# EAGLE design MORIKAWA_DS (EAGLE 5.11)
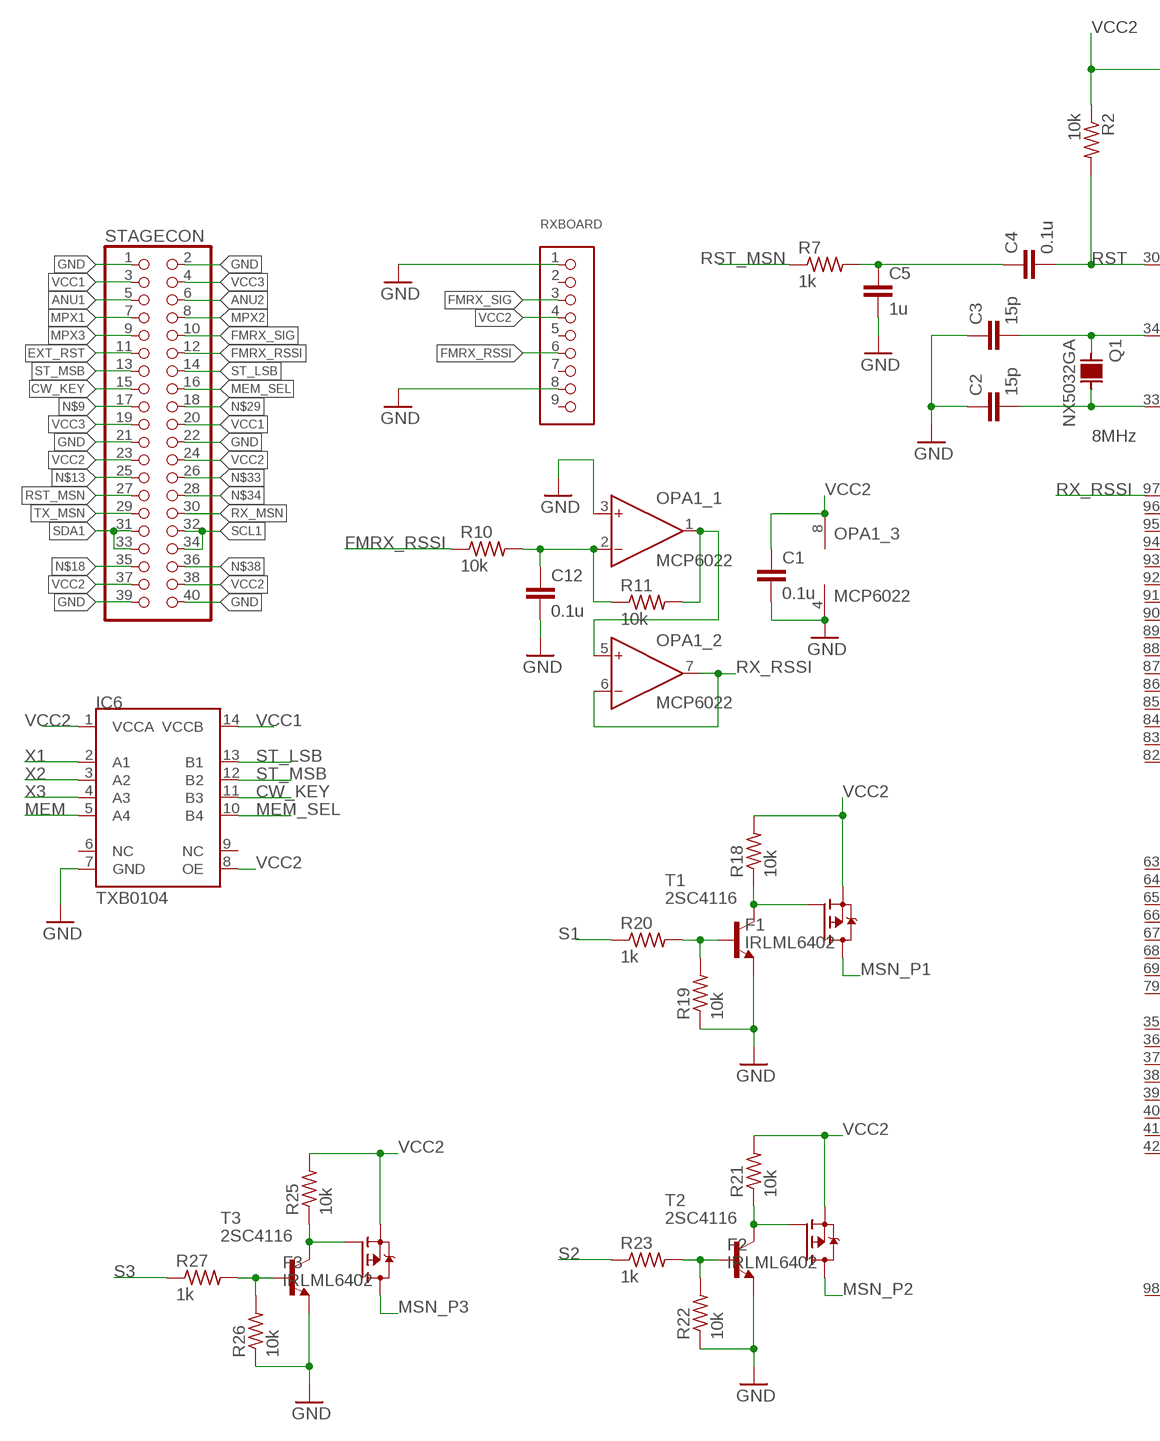
[diagram p0: schematic, sheet 1, part 1 of 2]
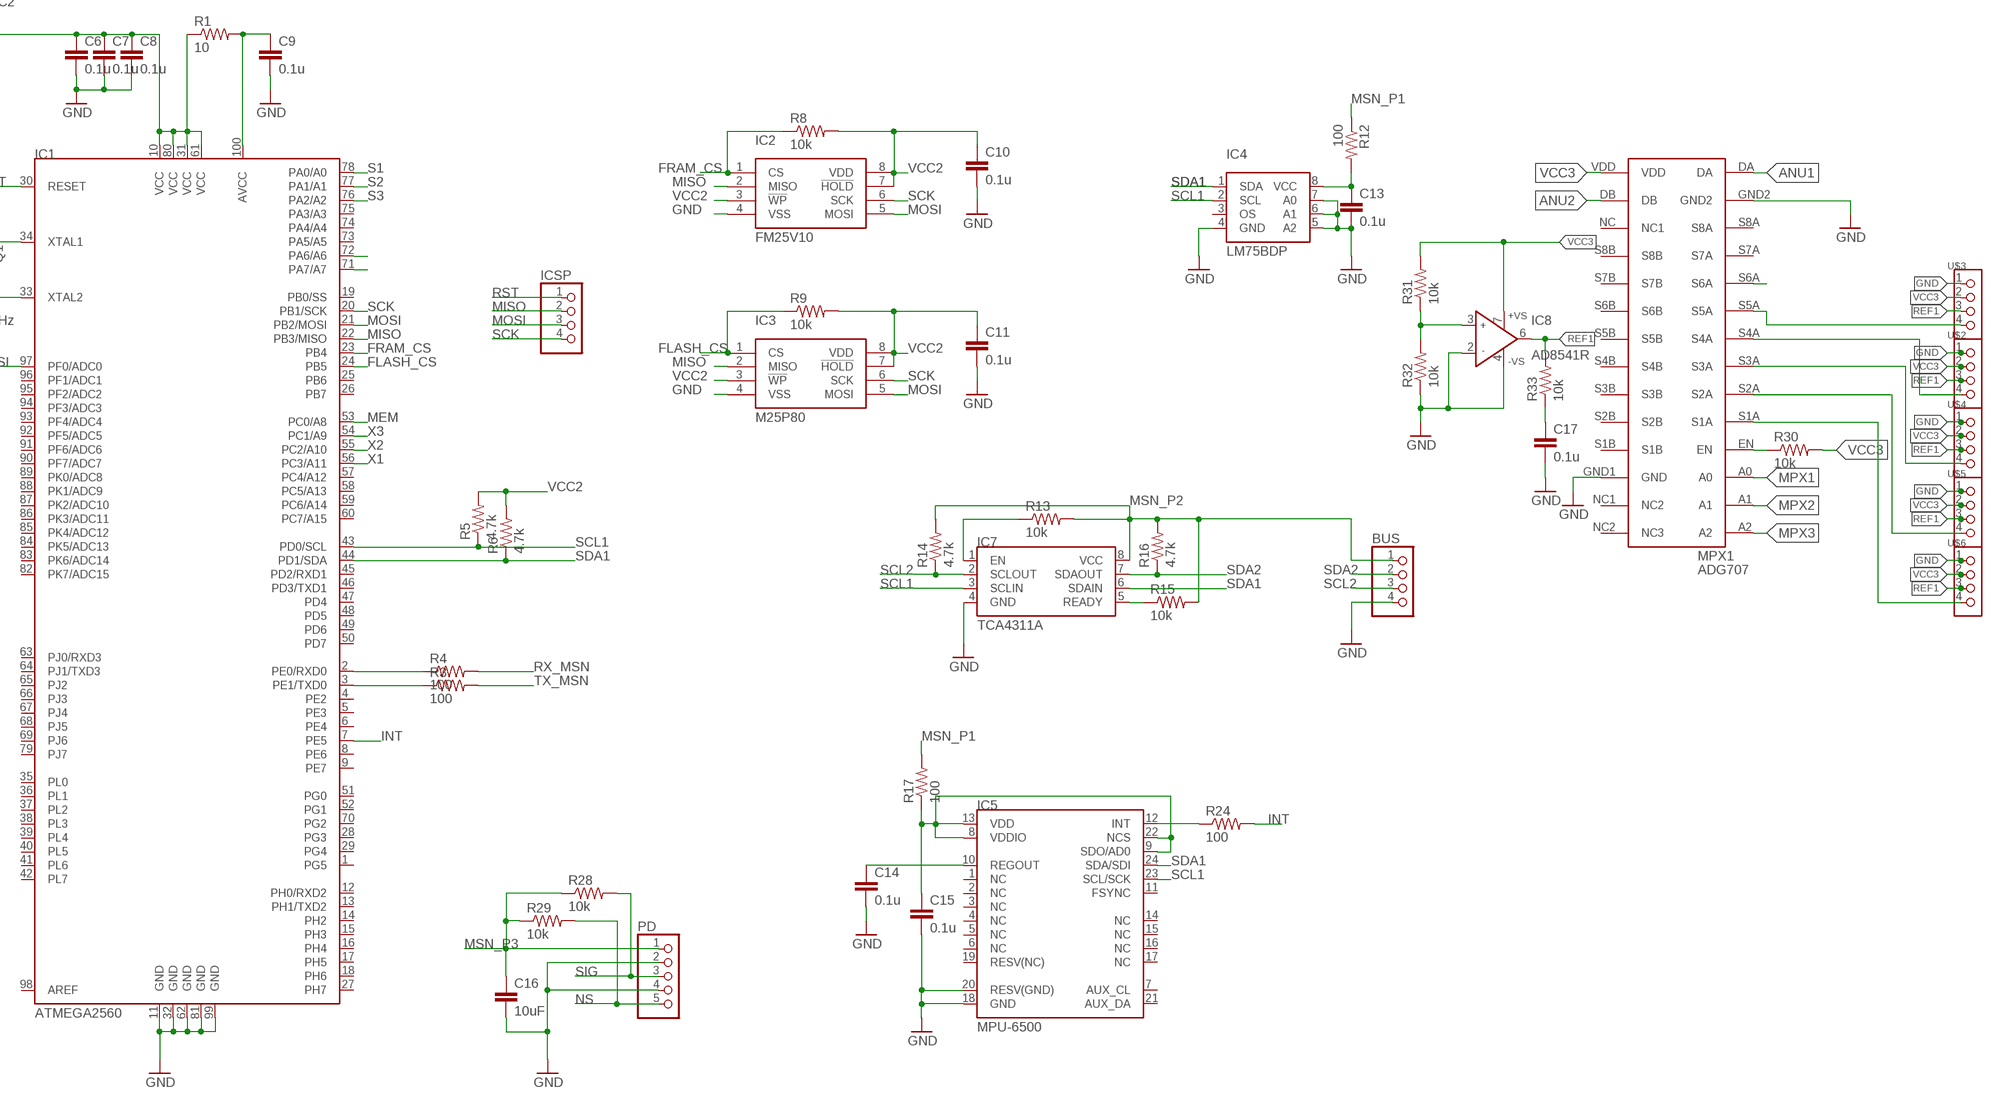
[diagram p1: schematic, sheet 1, part 2 of 2]

## Parts
BUS  PINHD-1X4  [1X04]
C1  0.1u  C-EUC0603  [C1608(0603)]
C2  15p  C-EUC0402  [C1015(0402)]
C3  15p  C-EUC0402  [C1015(0402)]
C4  0.1u  C-EUC0603  [C1608(0603)]
C5  1u  C-EUC0603  [C1608(0603)]
C6  0.1u  C-EUC0402  [C1015(0402)]
C7  0.1u  C-EUC0402  [C1015(0402)]
C8  0.1u  C-EUC0402  [C1015(0402)]
C9  0.1u  C-EUC0402  [C1015(0402)]
C10  0.1u  C-EUC0402  [C1015(0402)]
C11  0.1u  C-EUC0402  [C1015(0402)]
C12  0.1u  C-EUC0402  [C1015(0402)]
C13  0.1u  C-EUC0402  [C1015(0402)]
C14  0.1u  C-EUC0402  [C1015(0402)]
C15  0.1u  C-EUC0402  [C1015(0402)]
C16  10uF  C-EUC0805  [C2012(0805)]
C17  0.1u  C-EUC0402  [C1015(0402)]
F1  IRLML6402  [SOT23]
F2  IRLML6402  [SOT23]
F3  IRLML6402  [SOT23]
IC1  ATMEGA2560  [TQFP100]
IC2  FM25V10  [SO08]
IC3  M25P80  FM25V10  [SO08]
IC4  LM75BDP  [TSSOP8]
IC5  MPU-6500  [QFN24]
IC6  TXB0104  [PW-14]
IC7  TCA4311A  [SO08]
IC8  AD8541R  [SO8]
ICSP  PINHD-1X4  [1X04]
MPX1  ADG707  [ADG707]
OPA1  MCP6022  [SO8]
PD  PINHD-1X5  [1X05]
Q1  NX5032GA  [NX5032GA]
R1  10  R-US_R0402  [R1005M(0603)]
R2  10k  R-US_R0402  [R1005M(0603)]
R3  100  R-US_R0402  [R1005M(0603)]
R4  100  R-US_R0402  [R1005M(0603)]
R5  4.7k  R-US_R0402  [R1005M(0603)]
R6  4.7k  R-US_R0402  [R1005M(0603)]
R7  1k  R-US_R0402  [R1005M(0603)]
R8  10k  R-US_R0402  [R1005M(0603)]
R9  10k  R-US_R0402  [R1005M(0603)]
R10  10k  R-US_R0402  [R1005M(0603)]
R11  10k  R-US_R0402  [R1005M(0603)]
R12  100  R-US_R0402  [R1005M(0603)]
R13  10k  R-US_R0402  [R1005M(0603)]
R14  4.7k  R-US_R0402  [R1005M(0603)]
R15  10k  R-US_R0402  [R1005M(0603)]
R16  4.7k  R-US_R0402  [R1005M(0603)]
R17  100  R-US_R0402  [R1005M(0603)]
R18  10k  R-US_R0402  [R1005M(0603)]
R19  10k  R-US_R0402  [R1005M(0603)]
R20  1k  R-US_R0402  [R1005M(0603)]
R21  10k  R-US_R0402  [R1005M(0603)]
R22  10k  R-US_R0402  [R1005M(0603)]
R23  1k  R-US_R0402  [R1005M(0603)]
R24  100  R-US_R0402  [R1005M(0603)]
R25  10k  R-US_R0402  [R1005M(0603)]
R26  10k  R-US_R0402  [R1005M(0603)]
R27  1k  R-US_R0402  [R1005M(0603)]
R28  10k  R-US_R0402  [R1005M(0603)]
R29  10k  R-US_R0402  [R1005M(0603)]
R30  10k  R-US_R0402  [R1005M(0603)]
R31  10k  R-US_R0402  [R1005M(0603)]
R32  10k  R-US_R0402  [R1005M(0603)]
R33  10k  R-US_R0402  [R1005M(0603)]
RXBOARD  RXBOARD  [RXBOARD]
STAGECON  PINHD-2X20  [2X20]
T1  2SC4116  [SC-70]
T2  2SC4116  [SC-70]
T3  2SC4116  [SC-70]
U$2  ZH-4-S  [ZH4P]
U$3  ZH-4-S  [ZH4P]
U$4  ZH-4-S  [ZH4P]
U$5  ZH-4-S  [ZH4P]
U$6  ZH-4-S  [ZH4P]

## Nets
ANU1: MPX1.DA STAGECON.5
ANU2: MPX1.DB STAGECON.6
CW_KEY: IC6.11(B3) STAGECON.15
EXT_RST: STAGECON.11
FLASH_CS: IC1.24(PB5) IC3.1(CS) R9.1
FMRX_RSSI: R10.1 RXBOARD.6 STAGECON.12
FMRX_SIG: RXBOARD.3 STAGECON.10
FRAM_CS: IC1.23(PB4) IC2.1(CS) R8.1
GND: BUS.4 C1.2 C2.1 C3.1 C5.2 C6.2 C7.2 C8.2 C9.2 C10.2 C11.2 C12.2 C13.2 C14.2 C15.2 C16.2 C17.2 IC1.11(GND) IC1.32(GND) IC1.62(GND) IC1.81(GND) IC1.99(GND) IC2.4(VSS) IC3.4(VSS) IC4.4(GND) IC4.5(A2) IC4.6(A1) IC4.7(A0) IC5.18(GND) IC5.20(RESV(GND)) IC6.7(GND) IC7.4(GND) IC8.2(IN-) IC8.4(-VS) MPX1.GND1(GND) MPX1.GND2 OPA1.3(_1:IN+) OPA1.4(_3:V-) PD.2 PD.4 R19.1 R22.1 R26.1 R32.1 RXBOARD.1 RXBOARD.8 STAGECON.1 STAGECON.2 STAGECON.21 STAGECON.22 STAGECON.39 STAGECON.40 T1.2(E) T2.2(E) T3.2(E) U$2.1 U$3.1 U$4.1 U$5.1 U$6.1
INT: IC1.7(PE5) R24.2
MEM: IC1.53(PC0/A8) IC6.5(A4)
MEM_SEL: IC6.10(B4) STAGECON.16
MISO: IC1.22(PB3/MISO) IC2.2(MISO) IC3.2(MISO) ICSP.2
MOSI: IC1.21(PB2/MOSI) IC2.5(MOSI) IC3.5(MOSI) ICSP.3
MPX1: MPX1.A0 STAGECON.7
MPX2: MPX1.A1 STAGECON.8
MPX3: MPX1.A2 STAGECON.9
MSN_P1: F1.3(D) R12.1 R17.2
MSN_P2: BUS.1 F2.3(D) IC7.8(VCC) R13.2 R14.2 R15.2 R16.2
MSN_P3: C16.1 F3.3(D) PD.1 R28.1 R29.1
N$1: IC5.12(INT) R24.1
N$2: C9.1 IC1.100(AVCC) R1.2
N$3: C12.1 OPA1.2(_1:IN-) R10.2 R11.1
N$4: C3.2 IC1.34(XTAL1) Q1.1
N$5: C2.2 IC1.33(XTAL2) Q1.2
N$6: IC1.2(PE0/RXD0) R4.1
N$7: IC1.3(PE1/TXD0) R3.1
N$8: C14.1 IC5.10(REGOUT)
N$9: STAGECON.17
N$10: F1.1(G) R18.1 T1.3(C)
N$11: OPA1.1(_1:OUT) OPA1.5(_2:IN+) R11.2
N$12: F2.1(G) R21.1 T2.3(C)
N$13: STAGECON.25
N$14: C13.1 IC4.8(VCC) R12.2
N$15: F3.1(G) R25.1 T3.3(C)
N$16: C4.1 C5.1 R7.2
N$17: R26.2 R27.2 T3.1(B)
N$18: STAGECON.35
N$19: IC7.5(READY) R15.1
N$20: IC7.1(EN) R13.1
N$21: R19.2 R20.2 T1.1(B)
N$22: IC1.72(PA6/A6)
N$23: C15.1 IC5.8(VDDIO) IC5.9(SDO/AD0) IC5.13(VDD) IC5.22(NCS) R17.1
N$24: R22.2 R23.2 T2.1(B)
N$25: IC1.71(PA7/A7)
N$27: MPX1.S1A U$6.4
N$28: MPX1.EN R30.1
N$29: STAGECON.18
N$30: MPX1.S2A U$5.4
N$31: MPX1.S3A U$4.4
N$32: MPX1.S4A U$2.4
N$33: STAGECON.26
N$34: STAGECON.28
N$35: IC8.3(IN+) R31.1 R32.2
N$36: MPX1.S5A U$3.4
N$37: MPX1.S6A
N$38: STAGECON.36
N$39: C17.1 R33.1
NS: PD.5 R29.2
REF1: IC8.6(OUT) R33.2 U$2.3 U$3.3 U$4.3 U$5.3 U$6.3
RST: C4.2 IC1.30(RESET) ICSP.1 R2.2
RST_MSN: R7.1 STAGECON.27
RX_MSN: R4.2 STAGECON.30
RX_RSSI: IC1.97(PF0/ADC0) OPA1.6(_2:IN-) OPA1.7(_2:OUT)
S1: IC1.78(PA0/A0) R20.1
S2: IC1.77(PA1/A1) R23.1
S3: IC1.76(PA2/A2) R27.1
SCK: IC1.20(PB1/SCK) IC2.6(SCK) IC3.6(SCK) ICSP.4
SCL1: IC1.43(PD0/SCL) IC4.2(SCL) IC5.23(SCL/SCK) IC7.3(SCLIN) R5.1 STAGECON.32 STAGECON.34
SCL2: BUS.3 IC7.2(SCLOUT) R14.1
SDA1: IC1.44(PD1/SDA) IC4.1(SDA) IC5.24(SDA/SDI) IC7.6(SDAIN) R6.1 STAGECON.31 STAGECON.33
SDA2: BUS.2 IC7.7(SDAOUT) R16.1
SIG: PD.3 R28.2
ST_LSB: IC6.13(B1) STAGECON.14
ST_MSB: IC6.12(B2) STAGECON.13
TX_MSN: R3.2 STAGECON.29
VCC1: IC6.14(VCCB) STAGECON.3 STAGECON.20
VCC2: C1.1 C6.1 C7.1 C8.1 C10.1 C11.1 F1.2(S) F2.2(S) F3.2(S) IC1.10(VCC) IC1.31(VCC) IC1.61(VCC) IC1.80(VCC) IC2.3(!WP) IC2.7(!HOLD) IC2.8(VDD) IC3.3(!WP) IC3.7(!HOLD) IC3.8(VDD) IC6.1(VCCA) IC6.8(OE) OPA1.8(_3:V+) R1.1 R2.1 R5.2 R6.2 R8.2 R9.2 R18.2 R21.2 R25.2 RXBOARD.4 STAGECON.23 STAGECON.24 STAGECON.37 STAGECON.38
VCC3: IC8.7(+VS) MPX1.VDD R30.2 R31.2 STAGECON.4 STAGECON.19 U$2.2 U$3.2 U$4.2 U$5.2 U$6.2
X1: IC1.56(PC3/A11) IC6.2(A1)
X2: IC1.55(PC2/A10) IC6.3(A2)
X3: IC1.54(PC1/A9) IC6.4(A3)
Unconnected: IC1.1(PG5) IC1.4(PE2) IC1.5(PE3) IC1.6(PE4) IC1.8(PE6) IC1.9(PE7) IC1.12(PH0/RXD2) IC1.13(PH1/TXD2) IC1.14(PH2) IC1.15(PH3) IC1.16(PH4) IC1.17(PH5) IC1.18(PH6) IC1.19(PB0/SS) IC1.25(PB6) IC1.26(PB7) IC1.27(PH7) IC1.28(PG3) IC1.29(PG4) IC1.35(PL0) IC1.36(PL1) IC1.37(PL2) IC1.38(PL3) IC1.39(PL4) IC1.40(PL5) IC1.41(PL6) IC1.42(PL7) IC1.45(PD2/RXD1) IC1.46(PD3/TXD1) IC1.47(PD4) IC1.48(PD5) IC1.49(PD6) IC1.50(PD7) IC1.51(PG0) IC1.52(PG1) IC1.57(PC4/A12) IC1.58(PC5/A13) IC1.59(PC6/A14) IC1.60(PC7/A15) IC1.63(PJ0/RXD3) IC1.64(PJ1/TXD3) IC1.65(PJ2) IC1.66(PJ3) IC1.67(PJ4) IC1.68(PJ5) IC1.69(PJ6) IC1.70(PG2) IC1.73(PA5/A5) IC1.74(PA4/A4) IC1.75(PA3/A3) IC1.79(PJ7) IC1.82(PK7/ADC15) IC1.83(PK6/ADC14) IC1.84(PK5/ADC13) IC1.85(PK4/ADC12) IC1.86(PK3/ADC11) IC1.87(PK2/ADC10) IC1.88(PK1/ADC9) IC1.89(PK0/ADC8) IC1.90(PF7/ADC7) IC1.91(PF6/ADC6) IC1.92(PF5/ADC5) IC1.93(PF4/ADC4) IC1.94(PF3/ADC3) IC1.95(PF2/ADC2) IC1.96(PF1/ADC1) IC1.98(AREF) IC4.3(OS) IC5.1(NC) IC5.2(NC) IC5.3(NC) IC5.4(NC) IC5.5(NC) IC5.6(NC) IC5.7(AUX_CL) IC5.11(FSYNC) IC5.14(NC) IC5.15(NC) IC5.16(NC) IC5.17(NC) IC5.19(RESV(NC)) IC5.21(AUX_DA) IC6.6(NC) IC6.9(NC) MPX1.NC1(NC2) MPX1.NC2(NC3) MPX1.NC(NC1) MPX1.S1B MPX1.S2B MPX1.S3B MPX1.S4B MPX1.S5B MPX1.S6B MPX1.S7A MPX1.S7B MPX1.S8A MPX1.S8B RXBOARD.2 RXBOARD.5 RXBOARD.7 RXBOARD.9

## Notes on the sheet
- 8MHz

## Library data of the parts
BUS = Basic_parts:PINHD-1X4: PIN HEADER
C1-C17 = capacitor:C-EU: CAPACITOR, European symbol
F1-F3 = FET:IRLML6402: IRLML6402 P-ch MosFET
IC1 = avr:ATMEGA2560: ATmega1280/2560 TQFP100 ATmega1280
IC2 IC3 = IC:FM25V10: SPI FRAM Cypress http://www.digikey.jp/product-detail/ja/FM25VN10-GTR/1140-1029-1-ND/2917720
IC4 = IC:LM75B: I2C Temp sensor NXP
IC5 = sensor:MPU-6500: invensense 6-axis Motion tracking device
IC6 = Levelconverter:TXB0104: TXB0104 4-BIT BIDIRECTIONAL VOLTAGE-LEVEL TRANSLATOR WITH AUTOMATIC DIRECTION SENSING AND ±15-kV ESD PROTECTION, TI
IC7 = Levelconverter:TCA4311A: hot swappable 2wire bus buffers TI
IC8 = IC:AD8541: General-Purpose CMOS Rail-to-Rail Amplifiers Source: http://www.analog.com/static/imported-files/data_sheets/AD8541_8542_8544.pdf; MPN: AD8541ARZ; OC_FARNELL: 9603859; OC_NEWARK: 31M4547
ICSP = PINHEAD_round:PINHD-1X4: PIN HEADER
MPX1 = ADG707:ADG707
OPA1 = OPamp:MCP6022: microchip buffer amp rail-to-rail http://ww1.microchip.com/downloads/en/DeviceDoc/21685d.pdf
PD = Basic_parts:PINHD-1X5: PIN HEADER
Q1 = OSC:NX5032GA: NX5032CA Nihon Denpa Kogyo Crystal SMD
R1-R33 = Resistor:R-US_: RESISTOR, American symbol
RXBOARD = util:RXBOARD
STAGECON = Basic:PINHD-2X20: PIN HEADER
T1-T3 = Transisitor:2SC4116: NPN Transistor 2SC4116
U$2-U$6 = ZHcon:ZH-4-S

## Board
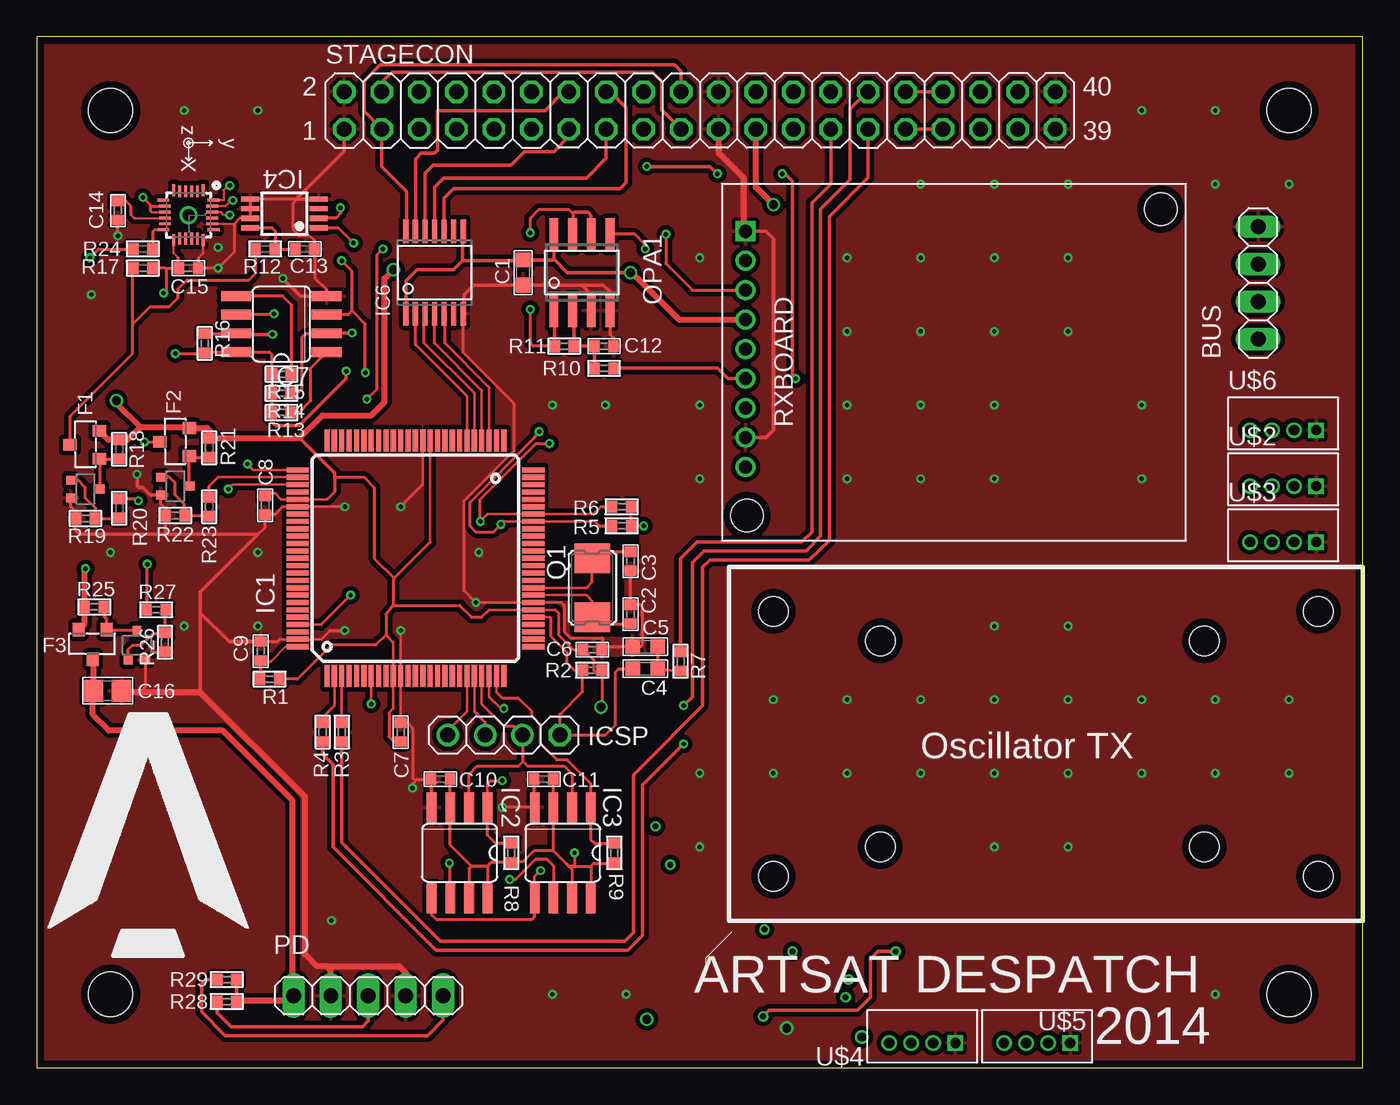
[diagram p2: board, top side]
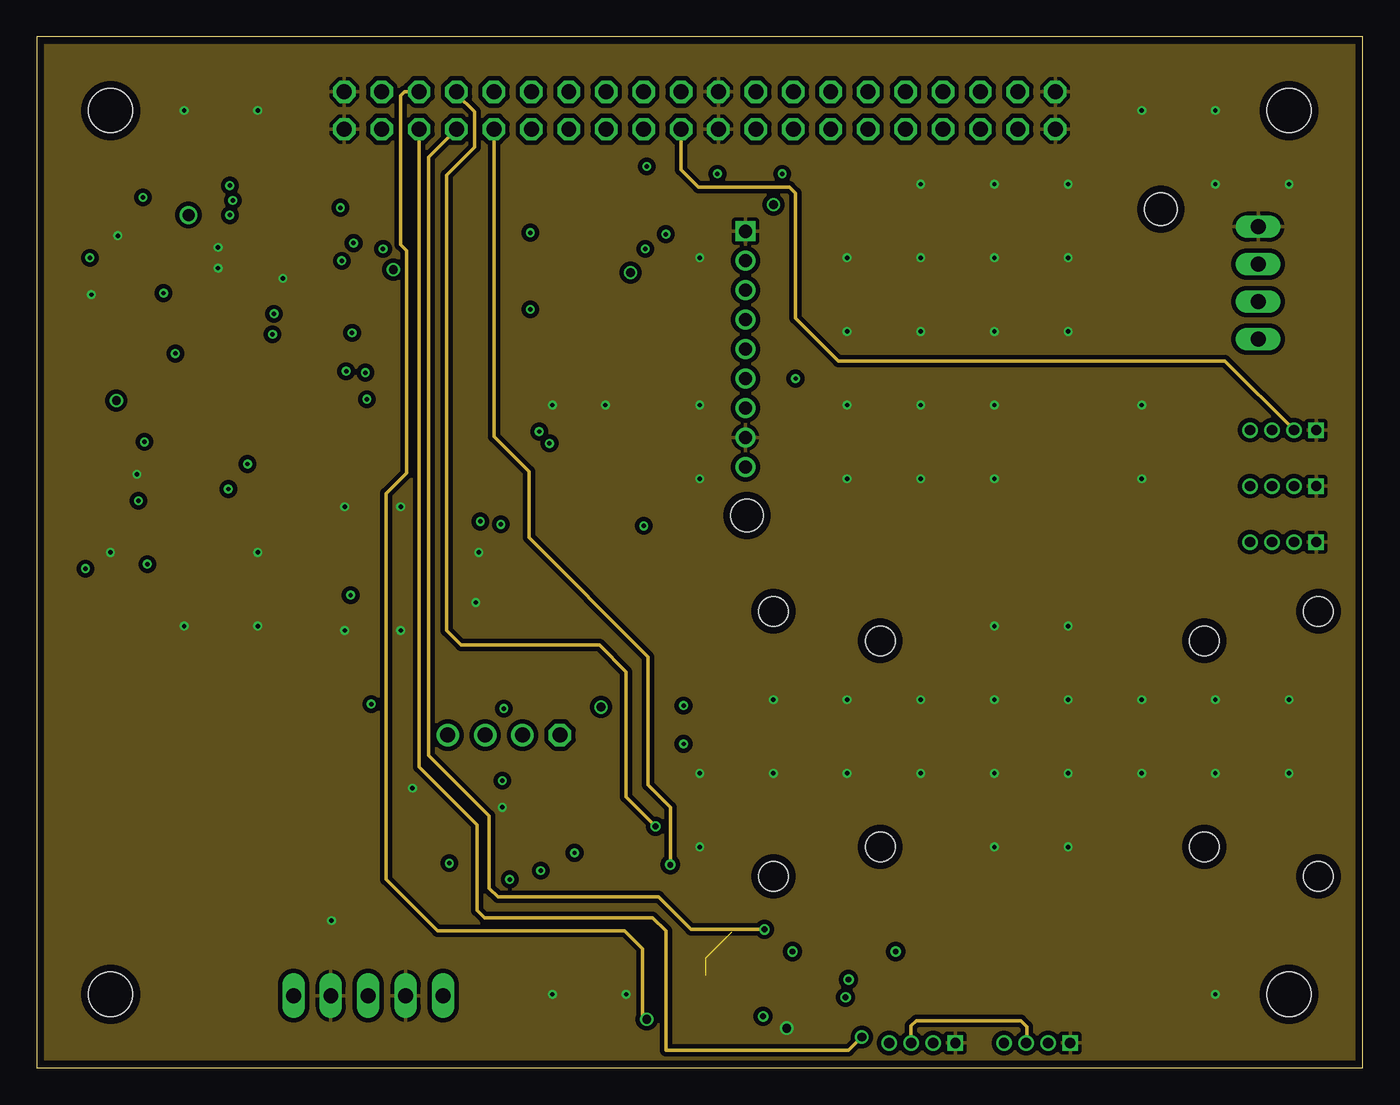
[diagram p3: board, inner layer Route2]
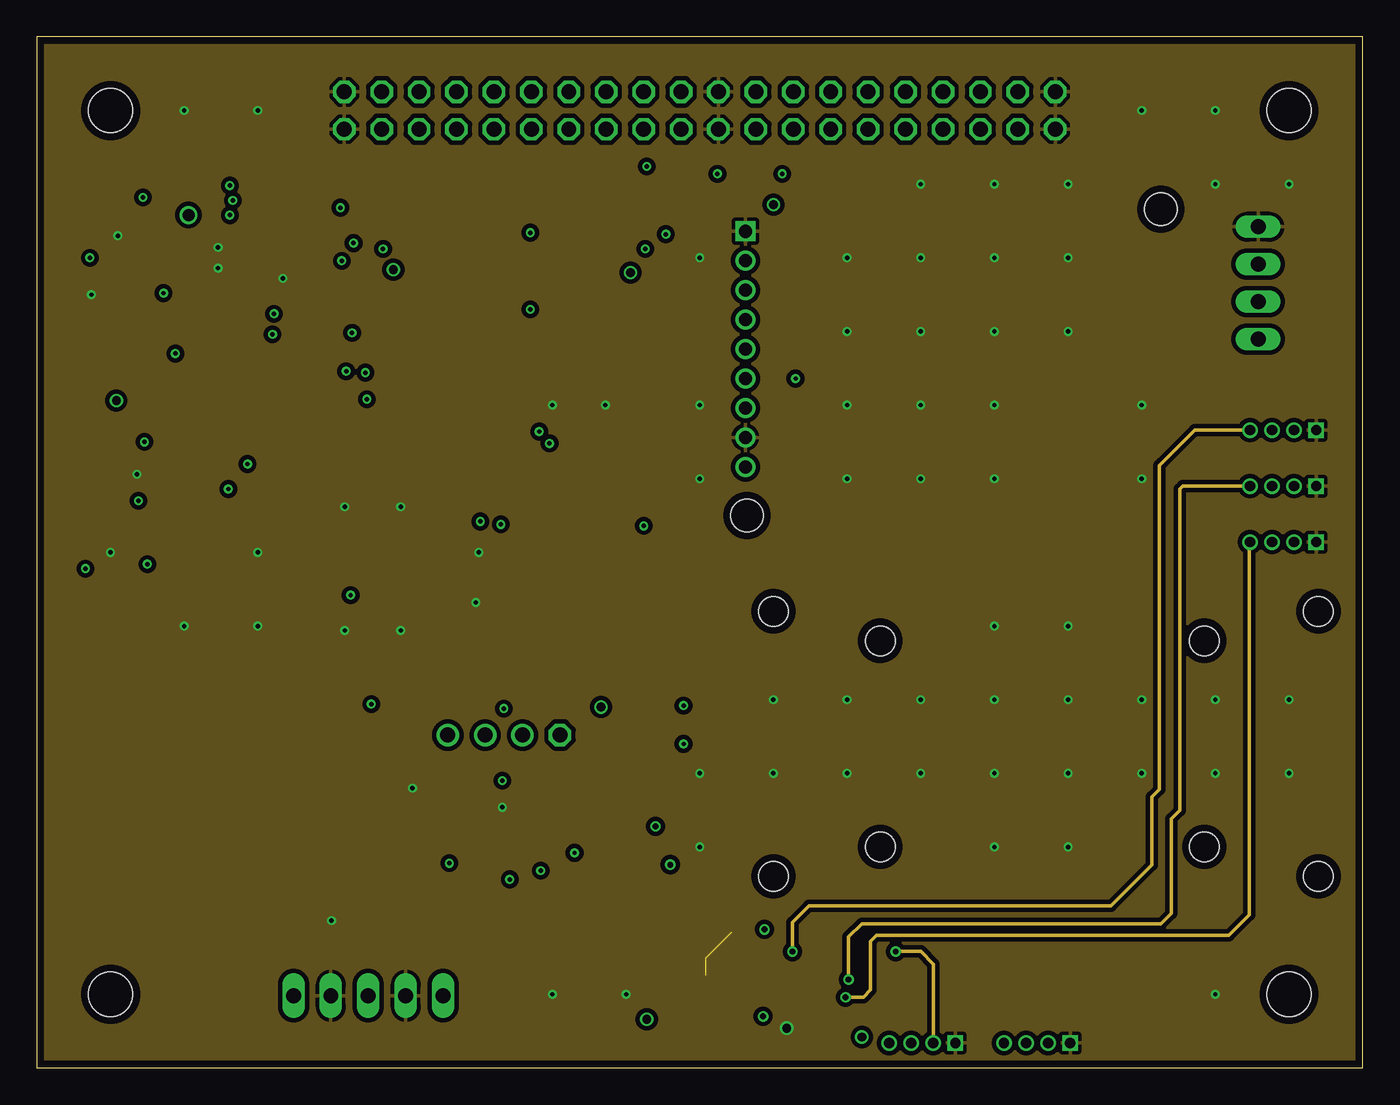
[diagram p4: board, inner layer Route15]
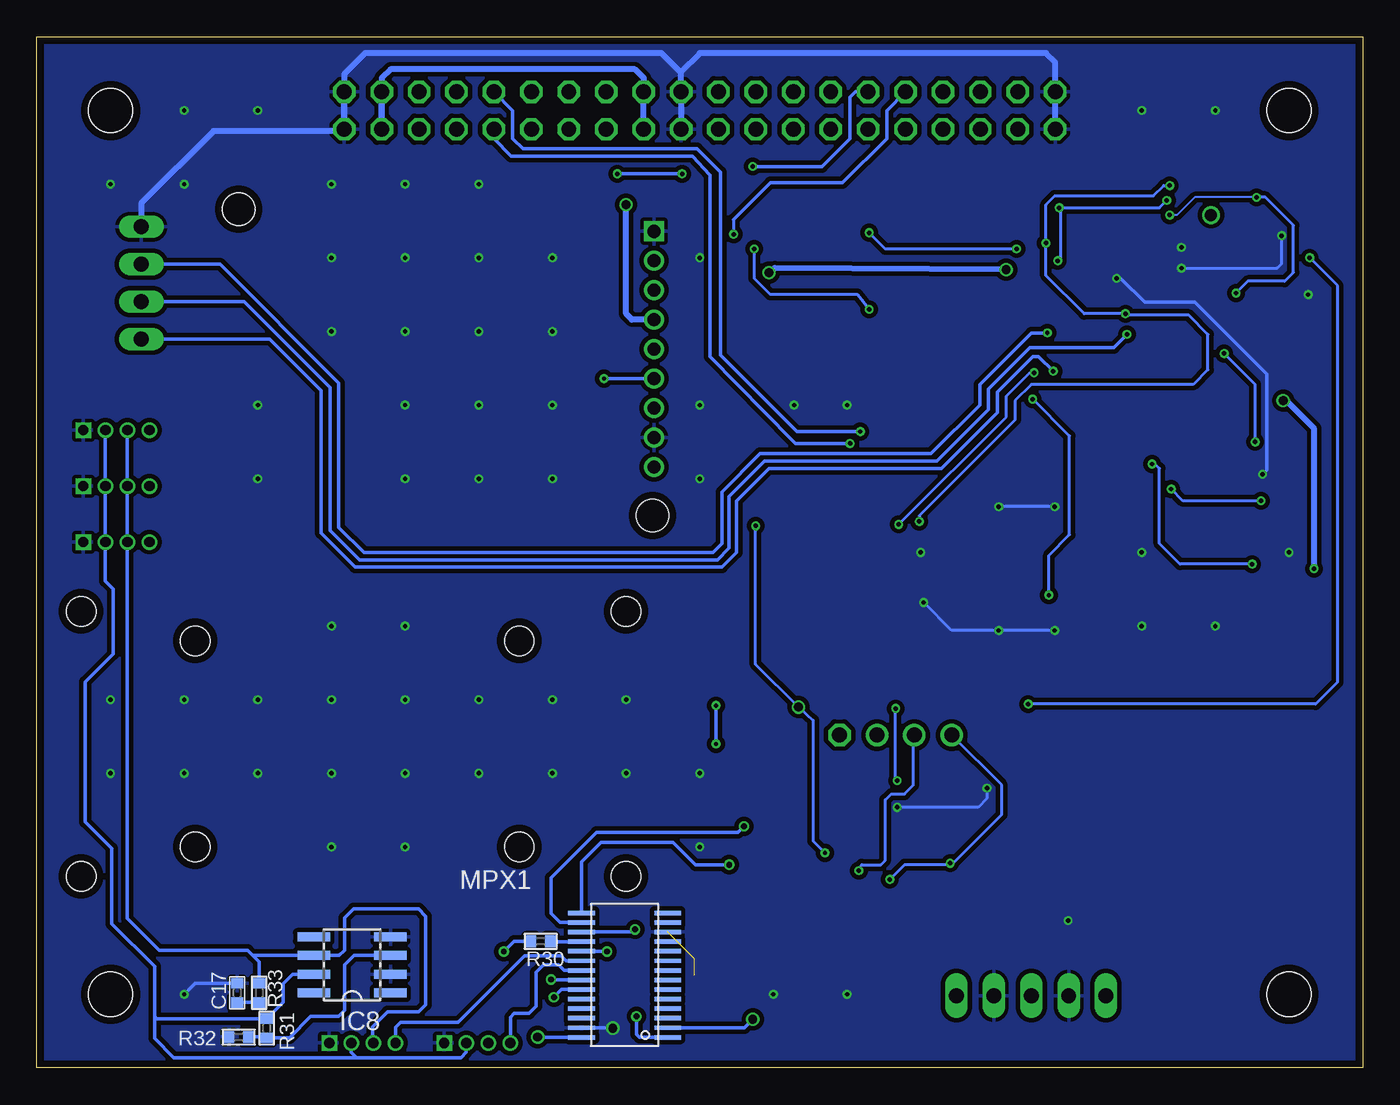
[diagram p5: board, bottom side, seen from below]

Size 90 x 70 mm. Coordinates in mm from the lower left corner, seen from the top.
Outline: 0,0 90,0 90,70 0,70 0,0
Copper layers (1+2*15+16): Top 0.018mm / dielectric 0.25mm / Route2 0.035mm / dielectric 1mm / Route15 0.035mm / dielectric 0.25mm / Bottom 0.018mm
Design rules "pban_5mil-l4": minimum track width 5mil, minimum drill 0.3mm, track to track 5mil, track to pad 0.229mm, pad to pad 5mil, via to via 5mil, smd to smd 5mil, copper to edge 0.5mm, drill to drill 0.5mm, minimum pad ring 0.15mm, minimum via ring 0.15mm, stop-mask expansion 4mil, vias tented up to drill 0.35mm, thermal gap 10mil
Holes 3 mm at 5,65 85,65 5,5 85,5
Holes 2 mm at 87,31 87,13 50,13 50,31 57.25,29 79.25,29 79.25,15 57.25,15
tRestrict: area 38.2,32 to 39,33.2; area 39.4,30.6 to 39.6,34.8; area 34.8,33 to 36.2,36.6; area 36.4,36 to 38.4,36.6; area 39,35.8 to 40.6,36; area 39.2,29.6 to 39.6,29.8; area 39,27.4 to 39.6,27.6; area 32.2,26.8 to 33.2,27.4; area 33,26.8 to 33.4,28; area 18.6,28 to 18.8,28.2; area 18.8,28.6 to 19.2,28.8; area 16.2,38.2 to 16.4,38.4

### Footprints (pad centres in the part's own frame; a part is rotated, then mirrored left to right if it is on the bottom)
1X04 = drill 1.016 long: 1 -3.81,0; 2 -1.27,0; 3 1.27,0; 4 3.81,0
C1608(0603) = smd 1 x 1: 1 -0.85,0; 2 0.85,0
C1015(0402) = smd 0.7 x 0.8: 1 -0.65,0; 2 0.65,0
C2012(0805) = smd 1.3 x 1.5: 1 -0.95,0; 2 0.95,0
SOT23 = smd 0.8 x 0.9: 1 -0.95,-0.95; 2 0.95,-0.95; 3 0,1.05
TQFP100 = smd 1.5 x 0.35: 1 -8,6; 2 -8,5.5; 3 -8,5; 4 -8,4.5; 5 -8,4; 6 -8,3.5; 7 -8,3; 8 -8,2.5; 9 -8,2; 10 -8,1.5; 11 -8,1; 12 -8,0.5; 13 -8,0; 14 -8,-0.5; 15 -8,-1; 16 -8,-1.5; 17 -8,-2; 18 -8,-2.5; 19 -8,-3; 20 -8,-3.5; 21 -8,-4; 22 -8,-4.5; 23 -8,-5; 24 -8,-5.5; 25 -8,-6; 51 8,-6; 52 8,-5.5; 53 8,-5; 54 8,-4.5; 55 8,-4; 56 8,-3.5; 57 8,-3; 58 8,-2.5; 59 8,-2; 60 8,-1.5; 61 8,-1; 62 8,-0.5; 63 8,0; 64 8,0.5; 65 8,1; 66 8,1.5; 67 8,2; 68 8,2.5; 69 8,3; 70 8,3.5; 71 8,4; 72 8,4.5; 73 8,5; 74 8,5.5; 75 8,6 | smd 0.35 x 1.5: 26 -6,-8; 27 -5.5,-8; 28 -5,-8; 29 -4.5,-8; 30 -4,-8; 31 -3.5,-8; 32 -3,-8; 33 -2.5,-8; 34 -2,-8; 35 -1.5,-8; 36 -1,-8; 37 -0.5,-8; 38 0,-8; 39 0.5,-8; 40 1,-8; 41 1.5,-8; 42 2,-8; 43 2.5,-8; 44 3,-8; 45 3.5,-8; 46 4,-8; 47 4.5,-8; 48 5,-8; 49 5.5,-8; 50 6,-8; 76 6,8; 77 5.5,8; 78 5,8; 79 4.5,8; 80 4,8; 81 3.5,8; 82 3,8; 83 2.5,8; 84 2,8; 85 1.5,8; 86 1,8; 87 0.5,8; 88 0,8; 90 -1,8; 92 -2,8; 93 -2.5,8; 94 -3,8; 95 -3.5,8; 96 -4,8; 97 -4.5,8; 98 -5,8; 99 -5.5,8; 100 -6,8 | smd 0.34 x 1.5: 89 -0.5,8; 91 -1.5,8
SO08 = smd 0.66 x 2.032: 1 -1.905,-3.073; 2 -0.635,-3.073; 3 0.635,-3.073; 4 1.905,-3.073; 5 1.905,3.073; 6 0.635,3.073; 7 -0.635,3.073; 8 -1.905,3.073
TSSOP8 = smd 1.2 x 0.35: 1 -2.325,0.975; 2 -2.325,0.325; 3 -2.325,-0.325; 4 -2.325,-0.975; 5 2.325,-0.975; 6 2.325,-0.325; 7 2.325,0.325; 8 2.325,0.975
QFN24 = smd 0.8 x 0.2: 1 -1.7,1; 2 -1.6,0.6; 3 -1.6,0.2; 4 -1.6,-0.2; 5 -1.6,-0.6; 6 -1.7,-1; 13 1.7,-1; 14 1.6,-0.6; 15 1.6,-0.2; 16 1.6,0.2; 17 1.6,0.6; 18 1.7,1 | smd 0.2 x 0.8: 7 -1,-1.7; 8 -0.6,-1.6; 9 -0.2,-1.6; 10 0.2,-1.6; 11 0.6,-1.6; 12 1,-1.7; 19 1,1.7; 20 0.6,1.6; 21 0.2,1.6; 22 -0.2,1.6; 23 -0.6,1.6; 24 -1,1.7
PW-14 = smd 0.35 x 1.6: 1 -1.95,-2.8; 2 -1.3,-2.8; 3 -0.65,-2.8; 4 0,-2.8; 5 0.65,-2.8; 6 1.3,-2.8; 7 1.95,-2.8; 8 1.95,2.8; 9 1.3,2.8; 10 0.65,2.8; 11 0,2.8; 12 -0.65,2.8; 13 -1.3,2.8; 14 -1.95,2.8
SO8 = smd 0.6 x 2.2: 1 -1.905,-2.6; 2 -0.635,-2.6; 3 0.635,-2.6; 4 1.905,-2.6; 5 1.905,2.6; 6 0.635,2.6; 7 -0.635,2.6; 8 -1.905,2.6
1X04' = drill 1.016 octagon: 1 -3.81,0 | drill 1.016 round: 2 -1.27,0; 3 1.27,0; 4 3.81,0
ADG707 = smd 1.8 x 0.3: A0 2.925,-2.925; A1 2.925,-3.575; A2 2.925,-4.225; DA 2.925,4.225; DB -2.925,3.575; EN 2.925,-2.275; GND1 -2.925,-2.925; GND2 2.925,3.575; NC -2.925,-3.575; NC1 -2.925,2.925; NC2 -2.925,-4.225; S1A 2.925,-1.625; S1B -2.925,-2.275; S2A 2.925,-0.975; S2B -2.925,-1.625; S3A 2.925,-0.325; S3B -2.925,-0.975; S4A 2.925,0.325; S4B -2.925,-0.325; S5A 2.925,0.975; S5B -2.925,0.325; S6A 2.925,1.625; S6B -2.925,0.975; S7A 2.925,2.275; S7B -2.925,1.625; S8A 2.925,2.925; S8B -2.925,2.275; VDD -2.925,4.225
1X05 = drill 1.016 long: 1 -5.08,0; 2 -2.54,0; 3 0,0; 4 2.54,0; 5 5.08,0
NX5032GA = smd 2 x 2.4: 1 -2,0; 2 2,0
R1005M(0603) = smd 0.7 x 0.8: 1 -0.65,0; 2 0.65,0
RXBOARD = drill 0.9 square: 1 29.9,3.2 | drill 0.9 round: 2 29.9,5.2; 3 29.9,7.2; 4 29.9,9.2; 5 29.9,11.2; 6 29.9,13.2; 7 29.9,15.2; 8 29.9,17.2; 9 29.9,19.2 | hole 2.2: 1.7,1.7; 29.8,22.5
2X20 = drill 1.016 octagon: 1 -24.13,-1.27; 2 -24.13,1.27; 3 -21.59,-1.27; 4 -21.59,1.27; 5 -19.05,-1.27; 6 -19.05,1.27; 7 -16.51,-1.27; 8 -16.51,1.27; 9 -13.97,-1.27; 10 -13.97,1.27; 11 -11.43,-1.27; 12 -11.43,1.27; 13 -8.89,-1.27; 14 -8.89,1.27; 15 -6.35,-1.27; 16 -6.35,1.27; 17 -3.81,-1.27; 18 -3.81,1.27; 19 -1.27,-1.27; 20 -1.27,1.27; 21 1.27,-1.27; 22 1.27,1.27; 23 3.81,-1.27; 24 3.81,1.27; 25 6.35,-1.27; 26 6.35,1.27; 27 8.89,-1.27; 28 8.89,1.27; 29 11.43,-1.27; 30 11.43,1.27; 31 13.97,-1.27; 32 13.97,1.27; 33 16.51,-1.27; 34 16.51,1.27; 35 19.05,-1.27; 36 19.05,1.27; 37 21.59,-1.27; 38 21.59,1.27; 39 24.13,-1.27; 40 24.13,1.27
SC-70 = smd 0.6 x 0.6: 1 -1,0.6; 2 -1,-0.6; 3 1,0
ZH4P = drill 0.7 square: 1 2.25,0 | drill 0.7 round: 2 0.75,0; 3 -0.75,0; 4 -2.25,0

### Placement (x,y rotation side)
BUS  82.9,53.3 90 top
C1  33,54 270 top
C2  40.3,30.8 270 top
C3  40.3,34.4 90 top
C4  41.3,27.1 180 top
C5  41.3,28.6 180 top
C6  37.7,28.4 0 top
C7  24.7,22.8 90 top
C8  15.5,38.2 270 top
C9  15.2,28.3 90 top
C10  27.4,19.6 180 top
C11  34.4,19.6 180 top
C12  38.5,49 0 top
C13  18.2,55.6 0 top
C14  5.5,58.2 270 top
C15  10.3,54.3 0 top
C16  4.8,25.6 0 top
C17  76.4,5.1 90 bottom
F1  3.3,42.3 90 top
F2  9.4,42.5 90 top
F3  3.8,28.8 180 top
IC1  25.7,34.6 90 top
IC2  28.7,14.6 180 top
IC3  35.7,14.6 180 top
IC4  16.8,58 180 top
IC5  10.3,57.9 270 top
IC6  27,54 0 top
IC7  16.6,50.5 90 top
IC8  68.6,7 90 bottom
ICSP  [1X04']  31.7,22.6 180 top
MPX1  50.1,6.3 180 bottom
OPA1  37,54 0 top
PD  22.5,4.9 0 top
Q1  37.7,32.6 270 top
R1  15.8,26.4 180 top
R2  37.7,27 180 top
R3  20.7,22.8 270 top
R4  19.4,22.8 270 top
R5  39.7,36.8 0 top
R6  39.7,38.1 0 top
R7  43.7,27.6 270 top
R8  32.2,14.6 270 top
R9  39.2,14.6 270 top
R10  38.5,47.5 180 top
R11  35.8,49 180 top
R12  15.5,55.6 0 top
R13  16.6,44.5 180 top
R14  16.6,45.8 180 top
R15  16.6,47.1 180 top
R16  11.4,49.2 270 top
R17  7.2,54.3 180 top
R18  5.6,42 90 top
R19  3.3,37.3 0 top
R20  5.6,38 270 top
R21  11.7,42.1 90 top
R22  9.4,37.5 0 top
R23  11.7,38.1 270 top
R24  7.2,55.6 180 top
R25  3.9,31.3 180 top
R26  8.7,28.9 90 top
R27  8.1,31.1 0 top
R28  12.9,4.5 180 top
R29  12.9,6 180 top
R30  55.8,8.6 180 bottom
R31  74.4,2.7 90 bottom
R32  76.3,2.1 0 bottom
R33  74.9,5.1 90 bottom
RXBOARD  78,60 180 top
STAGECON  45,65 0 top
T1  3.3,39.3 0 top
T2  9.4,39.5 0 top
T3  6.8,28.7 90 top
U$1  [ARTSAT_LOGO_16MM]  0.1,6.3 0 top
U$2  84.6,39.5 0 top
U$3  84.6,35.7 0 top
U$4  60.1,1.7 0 top
U$5  67.9,1.7 0 top
U$6  84.6,43.3 0 top

### Tracks (layer width: path | path; a pad name or v marks a point on that pad's centre or on a via)
ANU1  (via drill 0.6)
  Route2 0.254: STAGECON.5 25.95,20.45 29.9,16.5 29.9,10.7 30.4,10.2 41.8,10.2 42.7,9.3 42.7,1.2 55.1,1.2 v56,2.1
  Bottom 0.254: v56,2.1 55.98,2.08 MPX1.DA
ANU2  (via drill 0.6)
  Route2 0.254: STAGECON.6 24.97,66.27 24.7,66 24.7,55.9 25.1,55.5 25.1,40.4 23.7,39 23.7,12.8 27.2,9.3 39.9,9.3 41.1,8.1 41.1,3.6 v41.4,3.3
  Bottom 0.254: v41.4,3.3 41.98,2.73 MPX1.DB
CW_KEY
  Top 0.254: IC6.11 27,59.8 27.6,60.4 37.3,60.4 38.65,61.75 STAGECON.15
FLASH_CS
  Top 0.18: 31.2,25.5 IC1.24
  Top 0.2: R9.1 37.85,15.25 37.6,15.5 IC3.1 37.6,19.3 36,20.9 35.3,20.9 34.2,22 34.2,23.3 33.6,23.9 33.6,24.2 32.7,25.1 31.6,25.1 31.2,25.5
FMRX_RSSI  (via drill 0.3)
  Top 0.25: R10.1 46.2,47.5 46.9,46.8 RXBOARD.6 | v41.4,61.2 45.7,61.2 v46.2,60.7 | v51.5,46.8 51.3,47 51.3,60.2 50.8,60.7 v50.6,60.7
  Bottom 0.25: STAGECON.12 34.43,66.27 34.8,65.9 34.8,63.1 | RXBOARD.6 v51.5,46.8 | v50.6,60.7 v46.2,60.7
  Bottom 0.254: 34.8,63.1 36.7,61.2 v41.4,61.2
FMRX_SIG  (via drill 0.3)
  Top 0.2: RXBOARD.3 44.5,52.8 42.7,54.6 v42.7,56.6
  Bottom 0.2: 42.7,57.6 v42.7,56.6
  Bottom 0.25: STAGECON.10 32.3,65 32.3,63.1 35.3,60.1 40.2,60.1 42.7,57.6
FRAM_CS  (via drill 0.3)
  Top 0.18: 30.7,25.2 IC1.23
  Top 0.2: R8.1 31.15,15.25 30.6,15.8 IC2.1 30.6,19.3 30.8,19.5 v31.6,19.5 | 30.7,25.2 31.5,24.4 v31.7,24.4
  Bottom 0.2: v31.7,24.4 31.7,19.6 v31.6,19.5
GND  (via drill 0.3, 0.6)  (2 unrouted)
  Top 0.14: 11.3,55.3 IC5.18 | 13.4,57.3 IC5.20
  Top 0.18: 35.6,31.6 IC1.32 v29.8,31.6 | C7.2 IC1.11 v24.7,29.7 | 19.3,29.1 IC1.99 16.5,29.1 | 26.2,39.6 IC1.62 | v20.9,38.1 IC1.81 16.7,38.1 | 11,55 11.3,55.3
  Top 0.2: C3.1 C2.1 40.95,31.45 41.1,31.3 41.1,28.7 41,28.6 C5.2 38.45,28.6 C6.2 38.4,28.55 38.4,29.2 36.2,29.2 35.8,29.6 35.8,31.4 35.6,31.6 | IC2.4 26.75,17.72 C10.2 25.8,19.6 25.7,19.5 | 33.75,17.72 C11.2 33.75,19.45 33.7,19.4 | 33.75,17.72 IC3.4 | 33.75,17.72 31.72,17.72 v31.6,17.7 | v25.5,19 25.5,19.3 25.7,19.5 | C7.2 25.15,23.45 25.5,23.1 25.5,19.7 25.7,19.5 | v20.9,29.7 19.9,29.7 19.3,29.1 | v24.7,38.1 26.2,39.6 | C9.2 16.35,28.95 16.5,29.1 | 11,55 11,54.35 C15.2 v12.3,54.3 13.4,55.4 13.4,57.3 13.78,57.67 IC4.7 | IC4.7 IC4.6 IC4.5 17.6,58.98 IC4.4 17.68,58.98 17.4,58.7 17.4,56.9 17.8,56.5 18.5,56.5 18.85,56.15 C13.2 18.9,55.55 18.9,53.6 19.67,52.83 IC7.4 | IC4.7 14.5,57.7 | T2.2 8.4,38.3 8.75,37.95 R22.1 8.75,36.35 | 8.75,36.35 8.6,36.2 2.9,36.2 2.6,36.5 2.6,37.25 R19.1 2.65,37.75 2.3,38.1 T1.2 | 16.7,38.1 16.2,37.6 15.55,37.6 C8.2 15.5,36.7 15,36.2 8.9,36.2 8.75,36.35 | R26.1 7.95,28.25 T3.2 7.4,25.9 7.1,25.6 C16.2 | IC6.7 28.95,48.55 32.4,45.1 32.4,41.9 29,38.5 29,32.4 v29.8,31.6 | C12.2 39.15,49.55 38.9,49.8 OPA1.4 | v5.5,56.5 C14.2
  Top 0.25: RXBOARD.1 49.5,56.8 50,56.3 50,43.3 49.5,42.8 RXBOARD.8 | 20.9,64.27 20.87,64.3 STAGECON.1 20.87,62.24 17.6,58.98 | 37,53.15 C1.2 29.65,53.15 29,52.5 29,51.25 IC6.7 | 37,53.15 38.45,53.15 38.9,52.7 OPA1.4 | OPA1.3 37.63,52.52 37,53.15 | 11.1,25.5 11.1,30.9 | 11.1,30.9 11.1,32.3 15,36.2 | C9.2 13.05,28.95 11.1,30.9 | IC7.4 17.89,52.41 v16.7,53.6 | v6.8,40.3 6.8,39.5 6.9,39.4 7.2,39.4 7.7,38.9 T2.2
  Top 0.4: 19.7,6.9 19,6.9 18.2,7.7 18.2,18.4 11.1,25.5 5.85,25.5 C16.2 | 19.7,6.9 24.6,6.9 25.1,6.4 25.1,4.8 25.04,4.86 PD.4 | PD.2 19.96,6.64 19.7,6.9 | RXBOARD.1 48,56.9 48,60.4 46.3,62.1 46.3,63.7
  Bottom 0.2: v31.6,17.7 26.1,17.7 25.5,18.3 v25.5,19 | v29.8,31.6 27.9,29.7 v24.7,29.7 v20.9,29.7 | v20.9,38.1 v24.7,38.1 | v5.5,56.5 5.5,54.6 5.8,54.3 v12.3,54.3
  Bottom 0.25: v16.7,53.6 16.4,53.6 14.8,52 11.4,52 6.5,47.1 6.5,40.6 v6.8,40.3
  Bottom 0.254: MPX1.GND2 50.92,2.73 v50.9,2.7 | C17.2 79.25,5.75 v80,5
  Bottom 0.4: STAGECON.39 STAGECON.40 | STAGECON.1 STAGECON.2 20.87,68.27 21.5,68.9 45,68.9 46.3,67.6 | STAGECON.21 STAGECON.22 46.3,66.3 46.3,67.6 | STAGECON.39 69.13,67.47 67.7,68.9 47.6,68.9 46.3,67.6 | BUS.4 82.9,58.7 78,63.6 69.26,63.6 STAGECON.39
  other vias: 10,65 15,65 75,65 80,65 80,60 85,60 70,60 65,60 60,60 60,55 65,55 70,55 70,50 65,50 60,50 60,45 65,45 65,40 60,40 55,40 55,45 55,50 55,55 75,40 75,45 55,25 55,20 60,20 60,25 65,25 65,20 70,20 70,25 75,25 75,20 80,20 80,25 85,25 85,20 50,25 50,20 65,30 70,30 70,15 65,15 40,5 35,5 45,15 45,20 10,30 15,30 15,35 5,35 35,45 38.6,45 45,45 45,40 30,35 20,10 45,55 12.3,55.7 3.7,52.5
  pour Top (isolate 0.3): 0,69 0,1 1,0 89,0 90,1 90,69 89,70 1,70
  pour Bottom (isolate 0.3): 0,70 0,0 90,0 90,70
  pour Route2 (isolate 0.3): 0,70 0,0 90,0 90,70
  pour Route15 (isolate 0.3): 0,70 0,0 90,0 90,70
INT  (via drill 0.3)
  Top 0.18: v22.7,24.7 IC1.7
  Top 0.2: R24.2 4.2,55.6 v3.6,55
  Bottom 0.2: v22.7,24.7 3.2,24.7 1.7,26.2 1.7,53.1 v3.6,55
MEM
  Top 0.18: IC1.53 30.7,46.2
  Top 0.2: 30.7,46.2 27.7,49.2 27.7,51.15 IC6.5
MEM_SEL
  Top 0.254: IC6.10 27.65,59.05 28.3,59.7 39.6,59.7 40,60.1 40,65.2 38.93,66.27 STAGECON.16
MISO
  Top 0.18: 30.2,24.7 IC1.22
  Top 0.2: IC3.2 36.34,19.96 35.8,20.5 33.3,20.5 33,20.8 | 33,20.8 33,22.57 ICSP.2 32.37,23.2 31.7,23.2 30.2,24.7 | IC2.2 29.34,19.93 29.9,20.5 32.7,20.5 33,20.8
MOSI  (via drill 0.3)
  Top 0.18: 29.7,24.2 IC1.21
  Top 0.2: ICSP.3 30.43,23.47 29.7,24.2 | IC2.5 26.8,10.4 27.1,10.1 33.6,10.1 33.8,10.3 IC3.5 33.8,12.99 v34.2,13.4
  Bottom 0.2: v34.2,13.4 34.2,13.6 34,13.8 32.7,13.8 32.4,14.1 32.4,18.2 32,18.6 31.1,18.6 30.5,19.2 30.5,22.53 ICSP.3
MPX1  (via drill 0.4)
  Route2 0.254: v49.4,9.4 44.4,9.4 42.2,11.6 31.3,11.6 30.7,12.2 30.7,17.1 26.6,21.2 26.6,61.84 STAGECON.7
  Bottom 0.254: MPX1.A0 49.58,9.22 v49.4,9.4
MPX2  (via drill 0.4)
  Route2 0.254: v42,16.4 40,18.4 40,26.9 38.2,28.7 28.8,28.7 27.8,29.7 27.8,60.6 29.7,62.5 29.7,64.9 28.49,66.11 STAGECON.8
  Bottom 0.254: v42,16.4 42.4,16 52,16 55.1,12.9 55.1,10.5 54.48,9.88 MPX1.A1
MPX3  (via drill 0.4)
  Route2 0.254: v43,13.8 43,17.7 41.5,19.2 41.5,27.9 33.4,36 33.4,40.5 31.03,42.87 STAGECON.9
  Bottom 0.254: MPX1.A2 53.02,13.97 51.7,15.3 46.8,15.3 45.3,13.8 v43,13.8
MSN_P1
  Top 0.2: R12.1 14.85,53.95 14.4,53.5 10.2,53.5 9.6,52.9 9.6,52.3 9,51.7 7.7,51.7 6.5,50.5 | 6.5,50.5 6.5,54.25 R17.2 | F1.3 2.25,44.25 6.5,48.5 6.5,50.5
MSN_P2  (via drill 0.3)
  Top 0.2: R13.2 R14.2 R15.2 15.95,48.45 15.8,48.6 IC7.8 11.45,48.59 R16.2 11.35,48.5 v9.4,48.5 | v7.3,42.5 F2.3
  Top 0.25: v21,47.3 21,46.8 17.8,43.6 16.2,43.6 15.9,43.9 15.9,44.45 R13.2
  Bottom 0.2: v7.3,42.5 7.3,46.4 v9.4,48.5
  Bottom 0.25: BUS.1 74.19,49.49 70.7,46 70.7,36.3 68.4,34 43.5,34 42.5,35 42.5,38.5 40.3,40.7 28.6,40.7 24.8,44.5 24.8,45.9 22.4,48.3 22,48.3 v21,47.3
MSN_P3
  Top 0.2: 3.85,27.7 F3.3
  Top 0.25: 14.01,4.59 13.7,4.6 13.6,4.5 R28.1 R29.1
  Top 0.4: 3.85,27.7 C16.1 3.8,25.55 3.8,24 4.9,22.9 12.6,22.9 17.35,18.15 17.35,4.97 PD.1 17.11,4.59 14.01,4.59
N$1
  Top 0.14: 8,56.9 IC5.12
  Top 0.18: 7.9,56.8 8,56.9
  Top 0.2: 7.9,56.8 7.9,55.65 R24.1
N$2
  Top 0.18: IC1.100 16.9,28.6 15.9,27.6
  Top 0.2: R1.2 15.15,27.6 C9.1 15.25,27.6 15.9,27.6
N$3
  Top 0.25: OPA1.2 36.45,51.31 R11.1 C12.1 R10.2
N$4
  Top 0.18: IC1.34 37.3,32.6
  Top 0.2: C3.2 38.15,35.05 Q1.1 37.7,33 37.3,32.6
N$5
  Top 0.18: IC1.33 37.3,32.1
  Top 0.2: C2.2 38.15,30.15 Q1.2 37.7,31.7 37.3,32.1
N$6
  Top 0.18: 20.2,24.6 IC1.2
  Top 0.2: R4.1 19.4,23.8 20.2,24.6
N$7
  Top 0.18: R3.1 IC1.3
N$8
  Top 0.14: 6.6,57.7 IC5.10
  Top 0.18: 6.4,57.9 6.6,57.7
  Top 0.2: 6.4,57.9 6.4,58.5 6,58.9 5.5,58.9 C14.1
N$10
  Top 0.2: T1.3 4.3,41.3 F1.1 R18.1
N$11  (via drill 0.3)
  Top 0.2: OPA1.5 40.6,56.6 41.3,55.9 v41.3,55.6 | v33.5,51.5 33.5,49.2 33.7,49 R11.2
  Top 0.25: R11.2 35.15,51.34 OPA1.1
  Bottom 0.2: v41.3,55.6 41.3,53.6 40.2,52.5 40.1,52.5 34.3,52.5 v33.5,51.5
N$12
  Top 0.2: R21.1 10.45,41.45 F2.1 10.35,39.55 T2.3
N$14
  Top 0.2: C13.1 R12.2 16.2,55.65 16.2,56.8 15.97,57.02 IC4.8
N$15
  Top 0.2: T3.3 6.75,29.75 F3.1 4.75,30.45 4.6,30.6 4.6,31.25 R25.1
N$16
  Top 0.2: R7.2 C4.1 C5.1
N$17
  Top 0.2: T3.1 6.2,28.4 6.5,28.7 7.1,28.7 7.9,29.5 8.65,29.5 R26.2 8.7,31.05 R27.2
N$19
  Top 0.2: IC7.5 16.7,52.41 17.3,51.8 17.3,47.15 R15.1
N$20
  Top 0.2: R13.1 17.8,44.5 18.6,45.3 18.6,47.52 IC7.1
N$21
  Top 0.2: T1.1 2.8,39.9 3.3,39.4 3.3,38.7 4,38 4,37.35 R19.2 5.55,37.3 R20.2
N$23  (via drill 0.3)
  Top 0.14: 9.3,55.3 IC5.13 | 7.8,58.1 IC5.9 | 12.5,58.1 IC5.22
  Top 0.15: 12.5,58.1 12.7,57.9 v13.1,57.9
  Top 0.18: 9.6,55 9.3,55.3 | 7.7,58.2 7.8,58.1
  Top 0.2: 8.7,54.3 R17.1 | 8.7,54.3 C15.1 9.6,54.35 9.6,55 | 7.7,58.6 7.7,58.2 | v7.2,59.1 7.6,58.7 7.7,58.6 | v8.6,52.6 8.8,52.8 8.8,54.2 8.7,54.3 | IC5.8 7.8,58.5 7.7,58.6
  Bottom 0.15: v13.1,57.9 12.6,57.9 11.4,59.1 v7.2,59.1
  Bottom 0.2: v7.2,59.1 6.6,59.1 4.7,57.2 4.7,54 5.3,53.4 7.8,53.4 v8.6,52.6
N$24
  Top 0.2: T2.1 9,40.1 9.4,39.7 9.4,38.9 10,38.3 10,37.55 R22.2 11.65,37.5 R23.2
N$26  (via drill 0.8)
  other vias: 10.3,57.9
N$27  (via drill 0.4)
  Route15 0.254: v51.3,7.9 51.3,9.9 52.4,11 72.9,11 75.7,13.8 75.7,18.4 76.2,18.9 76.2,40.9 76.35,41.05 78.6,43.3 U$6.4
  Bottom 0.254: MPX1.S1A 51.33,7.92 v51.3,7.9
N$28
  Bottom 0.254: R30.1 55.12,8.57 MPX1.EN
N$30
  Bottom 0.254: MPX1.S2A 54.08,7.28 54.4,7.6 56.9,7.6 61.4,3.1 65.3,3.1 65.65,2.75 U$5.4
N$31
  Bottom 0.254: U$4.4 57.85,3.45 57.6,3.7 56.6,3.7 56.1,4.2 56.1,6.5 55.6,7 54.6,7 54.23,6.62 MPX1.S3A
N$32  (via drill 0.4)
  Route15 0.254: v55.1,6 55.1,8.9 56,9.8 76.3,9.8 77,10.5 77,16.9 77.6,17.5 77.6,39.3 77.8,39.5 U$2.4
  Bottom 0.254: MPX1.S4A 53.05,6 v55.1,6
N$35
  Bottom 0.254: R32.2 74.4,2.1 R31.1 72.85,2.05 71.4,3.5 69.5,3.5 69.1,3.9 69.1,7 68.47,7.63 IC8.3
N$36  (via drill 0.4)
  Route15 0.254: v54.9,4.8 56.1,4.8 56.6,5.3 56.6,8.6 57,9 80.9,9 82.3,10.4 82.3,35.65 U$3.4
  Bottom 0.254: MPX1.S5A 54.38,5.33 v54.9,4.8
N$39
  Bottom 0.254: R33.1 C17.1
NS
  Top 0.25: R29.2 11.5,6 11.2,5.7 11.2,3.8 12.8,2.2 26.52,2.2 27.58,3.26 PD.5
REF1
  Route2 0.254: U$4.3 59.35,2.85 59.7,3.2 66.8,3.2 67.2,2.8 67.2,1.75 U$5.3
  Bottom 0.254: U$6.3 U$2.3 U$3.3 83.85,10.15 81.7,8 75.7,8 75.33,7.63 | 75.33,7.63 74.9,7.2 R33.2 74.89,5.74 | 75.33,7.63 IC8.6 69.47,7.63 69.1,8 69.1,10.2 68.5,10.8 64.1,10.8 63.6,10.3 63.6,4.3 64.1,3.8 66.2,3.8 67.2,2.8 67.2,1.75 U$5.3
RST
  Top 0.18: 34.8,30.6 IC1.30
  Top 0.2: 34.8,30.6 34.9,30.5 34.9,29.3 36,28.2 36,27.5 36.5,27 R2.2 37.05,25.55 35.5,24 ICSP.1 38.6,22.6 39.3,23.3 39.3,26.9 39.5,27.1 C4.2
RST_MSN
  Top 0.25: STAGECON.27 53.89,59.99 52.6,58.7 52.6,36.4 51.9,35.7 44.8,35.7 43.7,34.6 R7.1
RX_MSN  (via drill 0.3)
  Top 0.25: STAGECON.30 56.37,66.27 55.2,65.1 55.2,60.3 53.2,58.3 53.2,36.1 52.2,35.1 45.3,35.1 44.5,34.3 44.5,25.2 v43.9,24.6 | R4.2 19.4,21.3 20.1,20.6 20.1,15 27.1,8 40.1,8 41.1,9 41.1,19.2 | 41.7,19.8 v43.9,22
  Top 0.254: 41.1,19.2 41.7,19.8
  Bottom 0.25: v43.9,22 v43.9,24.6
RX_RSSI  (via drill 0.3)
  Top 0.18: IC1.97 19.3,30.1
  Top 0.2: 19.3,30.1 v21.3,32.1 | v22.4,45.4 23.1,46.1 23.1,55.2 v23.5,55.6 | v33.5,56.7 33.5,57.7 34.1,58.3 36.1,58.3 36.4,58 36.4,56.63 OPA1.7
  Top 0.254: OPA1.6 37.63,57.87 37.4,58.1 36.5,58.1 36.4,58
  Bottom 0.2: v21.3,32.1 21.3,34.8 19.9,36.2 19.9,42.9 v22.4,45.4 | v23.5,55.6 32.4,55.6 v33.5,56.7
S1  (via drill 0.3)
  Top 0.18: 13.3,39.6 IC1.78
  Top 0.2: R20.1 6.75,38.65 v6.9,38.5 | v13,39.3 13.3,39.6
  Bottom 0.2: v6.9,38.5 12.2,38.5 v13,39.3
S2
  Top 0.18: 12.3,40.1 IC1.77
  Top 0.2: R23.1 11.7,39.5 12.3,40.1
S3  (via drill 0.3)
  Top 0.18: 14.7,40.6 IC1.76
  Top 0.2: v14.3,41 14.7,40.6 | v7.5,34.2 7.5,31.2 7.4,31.1 R27.1
  Bottom 0.2: v14.3,41 14.1,41 13.8,40.7 13.8,35.6 12.4,34.2 v7.5,34.2
SCK  (via drill 0.3)
  Top 0.18: 29.2,24.2 IC1.20
  Top 0.2: ICSP.4 27.89,22.89 29.2,24.2 | IC3.6 35.06,13.73 34.6,14.2 33.9,14.2 32.5,12.8 v32.1,12.8 | IC2.6 28.07,13.66 v28,13.9
  Bottom 0.2: v32.1,12.8 31.1,13.8 28.1,13.8 v28,13.9 27.8,13.9 24.5,17.2 24.5,19.2 27.8,22.5 27.8,22.51 ICSP.4
SCL1  (via drill 0.3)
  Top 0.14: v13.3,58.9 12.8,58.5 IC5.23
  Top 0.18: 37.9,37.1 IC1.43 31.7,37.1
  Top 0.2: 37.9,37.1 38.2,36.8 R5.1 | IC4.2 20.23,57.67 20.3,57.7 20.62,58.02 20.62,58.33 v20.6,58.4 | IC7.3 21.14,51.13 21.4,51.4 | 21.4,51.4 21.4,54.1 v20.7,54.8 | 31.7,37.1 v31.5,36.9 31,36.4 29.8,36.4 29.4,36.8 29.4,38.4 33.7,42.7 v34.1,43.2 | v22.3,47.2 22.3,50.5 21.4,51.4
  Top 0.25: STAGECON.32 STAGECON.34
  Bottom 0.2: v13.3,58.9 13.8,58.4 v20.6,58.4 20.5,58.3 20.5,55 v20.7,54.8 | v31.5,36.9 24.2,44.2 24.2,45.6 22.6,47.2 v22.3,47.2
  Bottom 0.25: STAGECON.32 57.7,65 57.7,63.1 57,62.4 45.2,62.4 43.6,60.8 43.6,48.4 38.4,43.2 v34.1,43.2
SCL2  (via drill 0.3)
  Top 0.2: IC7.2 18.27,49.87 18,49.6 18,46.1 17.7,45.8 R14.1
  Top 0.25: v21.4,49.9 19.71,49.9 IC7.2
  Bottom 0.25: BUS.3 77.57,54.57 69.5,46.5 69.5,36.7 67.8,35 44.1,35 43.5,35.6 43.5,39.1 40.9,41.7 29.3,41.7 26,45 26,46.4 22.5,49.9 v21.4,49.9
SDA1  (via drill 0.3)
  Top 0.14: IC5.24 12.7,58.9 12.7,59.6
  Top 0.18: 37.8,37.6 IC1.44 30.6,37.6 | v13.1,59.9 13,59.9 12.7,59.6
  Top 0.2: R6.1 38.3,38.1 37.8,37.6 | IC4.1 20.48,57.02 v21.5,56 | IC7.6 16.04,51.13 v16.1,51.2 | 30.6,37.6 v30.1,37.1 30.1,38.6 33.9,42.4 v34.8,42.4
  Top 0.25: STAGECON.31 STAGECON.33
  Bottom 0.2: v13.1,59.9 13.5,59.9 14.2,59.2 20.9,59.2 21.5,58.6 v21.5,56 21.5,53.8 18.9,51.2 v16.1,51.2 16,51.1 11.8,51.1 10.5,49.8 10.5,47.4 11.5,46.4 22.5,46.4 23.6,45.3 23.6,44 30.1,37.5 v30.1,37.1
  Bottom 0.25: STAGECON.31 58.97,63.07 57.8,61.9 45.5,61.9 44.3,60.6 44.3,48.3 38.7,42.6 38.5,42.4 v34.8,42.4
SDA2  (via drill 0.3)
  Top 0.2: R16.1 14.05,49.85 14.1,49.8 13.59,49.8 IC7.7
  Top 0.25: 14.1,49.8 v16,49.8
  Bottom 0.25: BUS.2 75.93,52.03 70.1,46.2 70.1,36.5 68.1,34.5 43.8,34.5 43,35.3 43,38.8 40.6,41.2 28.9,41.2 25.4,44.7 25.4,46.1 22.6,48.9 16.9,48.9 v16,49.8
SIG
  Top 0.25: R28.2 12.25,3.75 13.2,2.8 22.1,2.8 22.5,3.2 22.5,4.52
  Top 0.4: 22.5,4.52 PD.3
ST_LSB
  Top 0.254: IC6.13 25.7,61.7 26.1,62.1 27,62.1 27.2,62.3 27.2,65 34.5,65 35.77,66.27 STAGECON.14
ST_MSB
  Top 0.254: IC6.12 26.35,60.75 26.9,61.3 32.2,61.3 33.1,62.2 35.1,62.2 36.11,63.21 STAGECON.13
TX_MSN
  Top 0.25: STAGECON.29 56.43,60.43 53.8,57.8 53.8,35.8 52.4,34.5 45.7,34.5 45.2,34 45.2,24.6 41.1,20.5 | R3.2 20.7,15.3 27.4,8.6 39.9,8.6 40.5,9.2 40.5,19.9
  Top 0.254: 40.5,19.9 41.1,20.5
VCC1
  Top 0.25: IC6.14 25.1,56.85 25.1,59.5 23.4,61.2 STAGECON.3 22.2,64.94 22.2,67 23.3,68.1 43.3,68.1 43.73,67.67 STAGECON.20
VCC2  (via drill 0.3, 0.6)
  Top 0.18: 35.2,31.1 IC1.31 30.7,31.1 | 37.8,27 37.85,26.95 | 24.2,24.4 IC1.10 24.2,28.9 | 26.7,35.7 IC1.61 | 16.6,38.6 IC1.80 19.7,38.6
  Top 0.2: 35.2,31.1 35.4,30.9 35.4,29.4 36.4,28.4 C6.1 37.6,27.9 37.8,27.7 37.8,27 | 37.85,26.95 37.95,26.95 R2.1 38.35,24.55 v38.3,24.5 | C11.1 35.06,19.59 IC3.3 35.06,14.73 | C10.1 28.07,19.59 IC2.3 28.07,15.13 29.5,13.7 | 30.6,13.7 30.85,13.95 R8.2 32.25,14 33,14 33.73,14.73 35.06,14.73 | 30.6,13.7 IC2.8 | IC2.7 29.34,13.54 29.5,13.7 | 37.6,13.71 IC3.8 | 37.6,13.71 37.8,13.9 39.15,13.9 R9.2 | 36.1,13.7 35.95,13.85 35.06,14.73 | 36.4,13.7 36.1,13.7 | 36.4,13.7 37.6,13.7 37.6,13.71 | 30.6,13.7 29.5,13.7 | v36.5,14.6 36.5,13.8 36.4,13.7 | C7.1 24.25,22.15 23.9,22.5 23.9,24.1 24.2,24.4 | R6.2 R5.2 v41.2,36.8 | 23.7,29.4 24.2,28.9 | 23.7,29.4 23.7,30.8 24.2,31.4 | 24.2,31.4 28.7,31.4 29.5,30.6 30.2,30.6 30.7,31.1 | 24.25,33.25 24.2,33.1 24.2,31.4 | 24.25,33.25 26.7,35.7 | R1.1 17.7,26.4 20,28.7 23,28.7 23.7,29.4 | 6.15,42.65 R18.2 | 10.3,43.5 F2.2 | 16.6,38.6 16.2,39 15.55,39 C8.1 | 24.25,33.25 22.9,34.6 22.9,39.4 22.2,40.1 20.2,40.1 20.2,39.1 19.7,38.6 | IC3.7 36.34,13.46 36.1,13.7
  Top 0.25: IC6.1 25.05,53.45 25.8,54.2 28.3,54.2 28.9,54.8 | 28.9,54.8 28.9,56.75 IC6.8 | v40.3,54 36,54 35.1,54.9 | 35.1,54.9 OPA1.8 | 28.9,54.8 32.95,54.8 C1.1 35.05,54.85 35.1,54.9 | 20.2,40.1 20.2,40.4 17.85,42.75
  Top 0.4: F2.2 11.55,43.45 11.7,43.3 R21.2 17.85,42.75 19.4,44.3 22.7,44.3 23.6,45.2 23.6,53.6 v24.2,54.2 | R18.2 4.85,42.65 F1.2 | 7,43.5 6.15,42.65 | 7,43.5 10.3,43.5 | F3.2 3.25,30.15 R25.2 3.25,33.85 v3.3,33.9 | v5.4,45.3 5.4,45.1 7,43.5 | RXBOARD.4 43.6,50.8 40.8,53.6 v40.3,54 | STAGECON.23 48.81,59.79 v50,58.6
  Bottom 0.2: v36.5,14.6 37.3,15.4 37.3,23.6 v38.3,24.5 41.2,27.4 v41.2,36.8
  Bottom 0.4: RXBOARD.4 49.6,50.8 50,51.2 v50,58.6 | STAGECON.38 STAGECON.37 66.59,67.21 66,67.8 49.4,67.8 48.8,67.2 STAGECON.24 STAGECON.23 | v24.2,54.2 39.9,54.3 v40.3,54 | v3.3,33.9 3.3,43.4 5.2,45.3 v5.4,45.3
VCC3  (via drill 0.4)
  Top 0.25: STAGECON.4 23.41,66.91 24.1,67.6 41.8,67.6 42.4,67 42.4,65.06 STAGECON.19
  Top 0.254: v49.3,3.5 49.7,3.9 55.7,3.9 56.6,4.8 56.6,7.4 57.1,7.9 v58.3,7.9
  Route2 0.254: U$6.2 80.65,48 54.4,48 51.5,50.9 51.5,59.4 51.1,59.8 44.9,59.8 43.73,60.97 STAGECON.19
  Route15 0.254: U$4.2 60.85,7.05 60,7.9 v58.3,7.9
  Bottom 0.254: U$6.2 U$2.2 U$3.2 85.35,33.05 84.8,32.5 84.8,28.1 86.7,26.2 86.7,16.7 84.9,14.9 84.9,9.8 82,6.9 82,3.5 | U$4.2 60.85,1.05 61.2,0.7 68.3,0.7 | 82,3.5 82,2 80.7,0.7 68.3,0.7 | 82,3.5 81.85,3.35 R31.2 73.28,4.46 73.28,5.71 72.64,6.37 IC8.7 | v49.3,3.5 49.3,2.3 49.08,2.08 MPX1.VDD | v58.3,7.9 57.6,8.6 R30.2 | U$5.2 68.65,1.05 68.3,0.7
X1
  Top 0.18: IC1.56 29.2,45.6
  Top 0.2: 29.2,45.6 25.7,49.1 IC6.2
X2
  Top 0.18: IC1.55 29.7,45.8
  Top 0.2: 29.7,45.8 26.3,49.2 26.3,51.15 IC6.3
X3
  Top 0.18: IC1.54 30.2,46
  Top 0.2: 30.2,46 27,49.2 IC6.4

### Text on the board
tPlace: 2 | 40 | z | y | 1 | 39 | X | Oscillator TX | ARTSAT DESPATCH | 2014
Document: 120mm | 80mm | 72mm